# Altium schematic sheet touchscreen.SchDoc: Touchscreen
size A4; Author: Marcel Hellwig; Organization: Hamburg Bit-Bots; Address1: Vogt-Kölln-Str. 30; Address2: 22527 Hamburg; Address3: Germany; Address4: www.bit-bots.de; DocumentNumber: 14; Revision: A; SheetNumber: 14; SheetTotal: 16; EMail: info@bit-bots.de
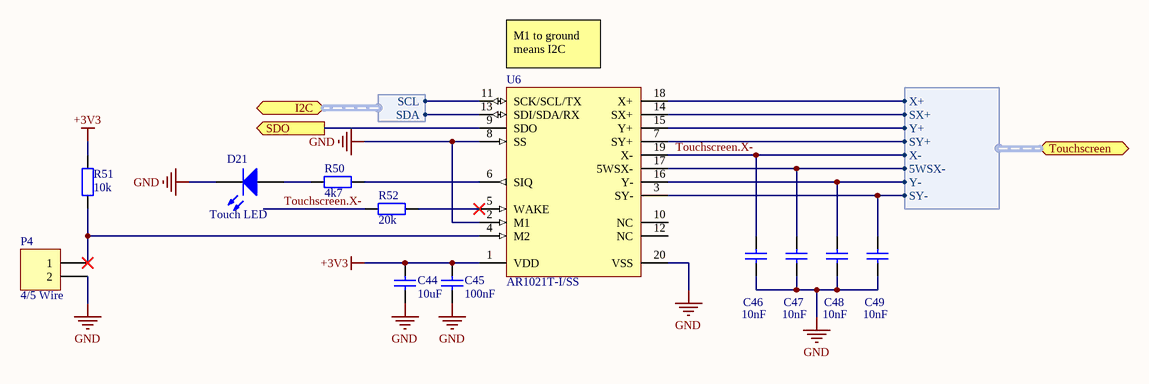
[diagram p0: touchscreen.SchDoc]

## Parts
C44  10uF  [C2012]
C45  100nF  [C2012]
C46  10nF  [C2012]
C47  10nF  [C2012]
C48  10nF  [C2012]
C49  10nF  [C2012]
D21  Touch LED  [MLCC2]
P4  4/5 Wire  [HDR1X2]  (no BOM)
R50  4k7  [R2012]
R51  10k  [R2012]
R52  20k  [R2012]
U6  AR1021T-I/SS  [MCHP-SSOP-SS20_N]

## Ports
I2C (harness I²C), SDO (out), Touchscreen (harness Touchscreen)

## Harnesses
I²C: SCL, SDA
Touchscreen: X+, SX+, Y+, SY+, X-, 5WSX-, Y-, SY-

## Nets
+3V3: C44.1 C45.1 R51.2 U6.1(VDD)
GND: C44.2 C45.2 C46.1 C47.1 C48.1 C49.1 D21.2(K) P4.2 U6.2(M1) U6.8(SS) U6.20(VSS)
SDO: U6.9(SDO) ; port SDO
Touchscreen.X-: C46.2 R52.1 U6.19(X-) ; port Touchscreen.X-
NetC47_2: C47.2 U6.17(5WSX-) ; port Touchscreen.5WSX-
NetC48_2: C48.2 U6.16(Y-) ; port Touchscreen.Y-
NetC49_2: C49.2 U6.3(SY-) ; port Touchscreen.SY-
NetD21_1: D21.1(A) R50.1
NetP4_1: P4.1 R51.1 U6.4(M2)
NetR50_2: R50.2 U6.6(SIQ)
NetR52_2: R52.2 U6.5(WAKE)
NetU6_7: U6.7(SY+) ; port Touchscreen.SY+
NetU6_11: U6.11(SCK/SCL/TX) ; port I2C.SCL
NetU6_13: U6.13(SDI/SDA/RX) ; port I2C.SDA
NetU6_14: U6.14(SX+) ; port Touchscreen.SX+
NetU6_15: U6.15(Y+) ; port Touchscreen.Y+
NetU6_18: U6.18(X+) ; port Touchscreen.X+

Not connected (* = marked no-connect by the designer): U6 10(NC) 12(NC)

## Notes on the sheet
- (near U6) M1 to ground means I2C
- Project:
- Author:
- Title:
- Rev:
- Date:
- Time:
- Sheet
- of

## Library data of the parts
C44 = Cap: Capacitor; Manufacturer: MULTICOMP; Manufacturer Part Number: MC0805X106K250CT; Produktpalette: Baureihe MC; Kapazität: 10; Kapazitätstoleranz: ±10%; Dielektrikum: X5; Nennspannung: 25; Keramikkondensatorgehäuse: 0805 [Metrisch 2012]; Betriebstemperatur, min.: -55; Betriebstemperatur, max.: 85; Verpackung: Gurtabschnitt; Kondensatoranschlüsse: SMD<!--FANDB--><div class="features-and-benefits-container"></div>; Published: 8-Jun-2000; LatestRevisionDate: 17-Jul-2002; LatestRevisionNote: Re-released for DXP Platform.; PackageReference: RAD-0.3; Publisher: Altium Limited; PackageDescription: Radial Cap, Thru-Hole; 2 Leads; 0.3 in Pin Spacing; Value: 10uF; Supplier 1: Farnell; Supplier Part Number 1: 2320833; RoHS: YES; Stock 1: 46180; Pricing 1: 10=0,147, 100=0,121, 500=0,1, 1000=0,083, 1500=0,066 (EUR); MSL: MSL 1 - unbegrenzt; Bauform: 0805 [Metrisch 2012]; Kapazitätstoleranz ±: ±10%; ComponentLink1URL: http://www.farnell.com/datasheets/1870456.pdf; ComponentLink1Description: http://www.farnell.com/datasheets/1870456.pdf
C45 = Cap: Capacitor; Manufacturer: MULTICOMP; Manufacturer Part Number: MC0805B104K500CT; Produktpalette: Baureihe MC; Kapazität: 0.1; Kapazitätstoleranz: ±10%; Dielektrikum: X7; Nennspannung: 50; Keramikkondensatorgehäuse: 0805 [Metrisch 2012]; Betriebstemperatur, min.: -55; Betriebstemperatur, max.: 125; Verpackung: Gurtabschnitt; SVHC: No SVHC (17-Dec-2014); Betriebstemperatur: -55°C bis +125; Kondensatoranschlüsse: SMD<!--FANDB--><div class="features-and-benefits-container"></div>; Published: 8-Jun-2000; LatestRevisionDate: 17-Jul-2002; LatestRevisionNote: Re-released for DXP Platform.; PackageReference: RAD-0.3; Publisher: Altium Limited; PackageDescription: Radial Cap, Thru-Hole; 2 Leads; 0.3 in Pin Spacing; Value: 100nF; Supplier 1: Farnell; Supplier Part Number 1: 1759265; RoHS: YES; Stock 1: 692437; Pricing 1: 10=0,013, 100=0,011, 500=0,009, 1000=0,008, 2000=0,006 (EUR); MSL: -; Bauform: 0805 [Metrisch 2012]; Kapazitätstoleranz ±: ±10%; ComponentLink1URL: http://www.farnell.com/datasheets/1870456.pdf; ComponentLink1Description: http://www.farnell.com/datasheets/1870456.pdf
C46-C49 = Cap: Capacitor; Manufacturer: MULTICOMP; Manufacturer Part Number: MC0805B103K500CT; Produktpalette: Baureihe MC; Kapazität: 0.01; Kapazitätstoleranz: ±10%; Dielektrikum: X7; Nennspannung: 50; Keramikkondensatorgehäuse: 0805 [Metrisch 2012]; Betriebstemperatur, min.: -55; Betriebstemperatur, max.: 125; Verpackung: Gurtabschnitt; SVHC: No SVHC (17-Dec-2014); Betriebstemperatur: -55°C bis +125; Kondensatoranschlüsse: SMD<!--FANDB--><div class="features-and-benefits-container"></div>; Published: 8-Jun-2000; LatestRevisionDate: 17-Jul-2002; LatestRevisionNote: Re-released for DXP Platform.; PackageReference: RAD-0.3; Publisher: Altium Limited; PackageDescription: Radial Cap, Thru-Hole; 2 Leads; 0.3 in Pin Spacing; Value: 10nF; Supplier 1: Farnell; Supplier Part Number 1: 1759246; RoHS: YES; Stock 1: 268277; Pricing 1: 10=0,013, 100=0,011, 500=0,009, 1000=0,008, 2000=0,006 (EUR); MSL: -; Bauform: 0805 [Metrisch 2012]; Kapazitätstoleranz ±: ±10%; ComponentLink1URL: http://www.farnell.com/datasheets/1870456.pdf; ComponentLink1Description: http://www.farnell.com/datasheets/1870456.pdf
D21 = LED0: Typical INFRARED GaAs LED; Manufacturer: VISHAY; Manufacturer Part Number: VLMC3100-GS08; Leuchtengröße: 2.4; LED-Farbe: Grün; Lichtstärke: 1.6; Abstrahlwinkel: 120°; Durchlassstrom If: 2; Durchlassspannung: 1.9; LED-Montage: Oberflächenmontage; Linsenform: Rund; Wellenlänge, typ.: 575; Verpackung: Gurtabschnitt; SVHC: No SVHC (16-Jun-2014); Betriebstemperatur: -40°C bis +100; Betriebstemperatur, max.: 100; Betriebstemperatur, min.: -40; LED-Typ: Standard; LED/Lampen Größe: PLCC-2; Montage: SMD; Sperrspannung: 6; Spitzenwellenlänge: 565; Winkel halber Empfindlichkeit ±: 60; Published: 8-Jun-2000; LatestRevisionDate: 08-Jul-2005; LatestRevisionNote: Mech Layer 1 removed.; PackageReference: LED-0; Publisher: Altium Limited; PackageDescription: LED; 2 Leads; Supplier 1: Farnell; Supplier Part Number 1: 1659076; RoHS: YES; Stock 1: 12975; Pricing 1: 5=0,105, 25=0,0998, 100=0,0952, 250=0,0917, 500=0,0865, 2000=0,0771, 4000=0,0717, 20000=0,0689 (EUR); MSL: MSL 2A - 4 Wochen; Anzahl der Pins: 2; Dominante Wellenlänge: 575; Durchlassspannung Vf max.: 2.4; Durchlassstrom If, max.: 2; Lichtstärke, typ.: 1.6; ComponentLink1URL: http://www.farnell.com/datasheets/1698102.pdf; ComponentLink1Description: http://www.farnell.com/datasheets/1698102.pdf
P4 = Header 2: Header, 2-Pin; LatestRevisionDate: 17-Jul-2002; LatestRevisionNote: Re-released for DXP Platform.; Publisher: Altium Limited
R50 = Res2: Resistor; Manufacturer: MULTICOMP; Manufacturer Part Number: MC01W080514K7; Published: 8-Jun-2000; LatestRevisionDate: 17-Jul-2002; LatestRevisionNote: Re-released for DXP Platform.; PackageReference: AXIAL-0.4; Publisher: Altium Limited; PackageDescription: Axial Device, Thru-Hole; 2 Leads; 0.4 in Pin Spacing; Value: 4k7; Supplier 1: Farnell; Supplier Part Number 1: 9333266; RoHS: Y-EX; Stock 1: 190984; Pricing 1: 50=0,038, 250=0,031, 1000=0,022, 5000=0,014, 15000=0,009 (EUR); ComponentLink1URL: http://www.farnell.com/datasheets/1729047.pdf; ComponentLink1Description: http://www.farnell.com/datasheets/1729047.pdf; ComponentLink2URL: http://www.farnell.com/cad/1561170.zip; ComponentLink2Description: http://www.farnell.com/cad/1561170.zip
R51 = Res2: Resistor; Manufacturer: MULTICOMP; Manufacturer Part Number: MC01W0805110K; Published: 8-Jun-2000; LatestRevisionDate: 17-Jul-2002; LatestRevisionNote: Re-released for DXP Platform.; PackageReference: AXIAL-0.4; Publisher: Altium Limited; PackageDescription: Axial Device, Thru-Hole; 2 Leads; 0.4 in Pin Spacing; Value: 10k; Supplier 1: Farnell; Supplier Part Number 1: 9332391; RoHS: Y-EX; Stock 1: 4370; Pricing 1: 50=0,038, 250=0,031, 1000=0,022, 5000=0,014, 15000=0,009 (EUR); ComponentLink1URL: http://www.farnell.com/datasheets/1729047.pdf; ComponentLink1Description: http://www.farnell.com/datasheets/1729047.pdf; ComponentLink2URL: http://www.farnell.com/cad/1561156.zip; ComponentLink2Description: http://www.farnell.com/cad/1561156.zip
R52 = Res2: Resistor; Manufacturer: MULTICOMP; Manufacturer Part Number: MCMR08X2002FTL; Produktpalette: Baureihe MCMR; Widerstand: 20; Nennleistung: 125; Widerstandstoleranz: ±1%; Bauform: 0805 [Metrisch 2012]; Widerstandselement: Keramik; Temperaturkoeffizient: ±100; Nennspannung: 150; Verpackung: Gurtabschnitt; SVHC: No SVHC (17-Dec-2014); Widerstandsmontage: Oberflächenmontage<!--FANDB--><div class="features-and-benefits-container"></div>; Published: 8-Jun-2000; LatestRevisionDate: 17-Jul-2002; LatestRevisionNote: Re-released for DXP Platform.; PackageReference: AXIAL-0.4; Publisher: Altium Limited; PackageDescription: Axial Device, Thru-Hole; 2 Leads; 0.4 in Pin Spacing; Value: 20k; Supplier 1: Farnell; Supplier Part Number 1: 2073683; RoHS: YES; Stock 1: 12300; Pricing 1: 100=0,014, 500=0,011, 1000=0,01 (EUR); MSL: -; ComponentLink1URL: http://www.farnell.com/datasheets/1716708.pdf; ComponentLink1Description: http://www.farnell.com/datasheets/1716708.pdf
U6 = CMP-0379-00026-1: AR1000 Series Resistive Touch Screen Controller, 1024 x 1024 Resolution, 3.3 Vdc, 5.5 Vdc power, SPI, I²C™ Communication, -40 to 85 degC, 20-pin SSOP (SS20), Tape and Reel; Manufacturer: Microchip; Manufacturer Part Number: AR1021-I/SS; IC-Schnittstelle: I2; Auflösung (Bit): 10; Versorgungsspannung, min.: 2.5; Versorgungsspannung, max.: 5; Anzahl der Pins: 20; Verpackung: Stückweise; SVHC: No SVHC (17-Dec-2014); Betriebstemperatur: -40°C bis +85; Betriebstemperatur, max.: 85; Versorgungsspannung: 2.5V bis 5; Mounting Technology: Surface Mount; ComponentLink4Description: Product URL; ComponentLink1Description: Manufacturer URL; PackageReference: SSOP-SS20; PartNumber: AR1021T-I/SS; DatasheetVersion: Rev. B; ComponentLink4URL: http://www.microchip.com/AR1021; ComponentLink1URL: http://www.microchip.com; PackageVersion: C04-072B; ComponentLink2URL: http://ww1.microchip.com/downloads/en/DeviceDoc/41393B.pdf; PackageDescription: 20-Lead Plastic Shrink Small Outline, 5.3 x 7.2 mm Body, 0.65 mm Pitch; ComponentLink3Description: Package Specification; ComponentLink3URL: http://www.microchip.com/stellent/groups/techpub_sg/documents/packagingspec/en012702.pdf; ComponentLink2Description: Datasheet; Supplier 1: Farnell; Supplier Part Number 1: 2218568; RoHS: YES; Stock 1: 355; Pricing 1: 1=1,85, 10=1,4, 100=1,28 (EUR); Bauform: SSOP; MSL: MSL 1 - unbegrenzt; Betriebstemperatur, min.: -40; Controllertyp: Touchscreen; ComponentLink5URL: http://www.microchip.com/mymicrochip/filehandler.aspx?ddocname=en544070; ComponentLink5Description: http://www.microchip.com/mymicrochip/filehandler.aspx?ddocname=en544070; ComponentLink6URL: http://www.farnell.com/cad/1726657.zip; ComponentLink6Description: http://www.farnell.com/cad/1726657.zip